# Altium schematic sheet RC_Interface.SchDoc
size A4
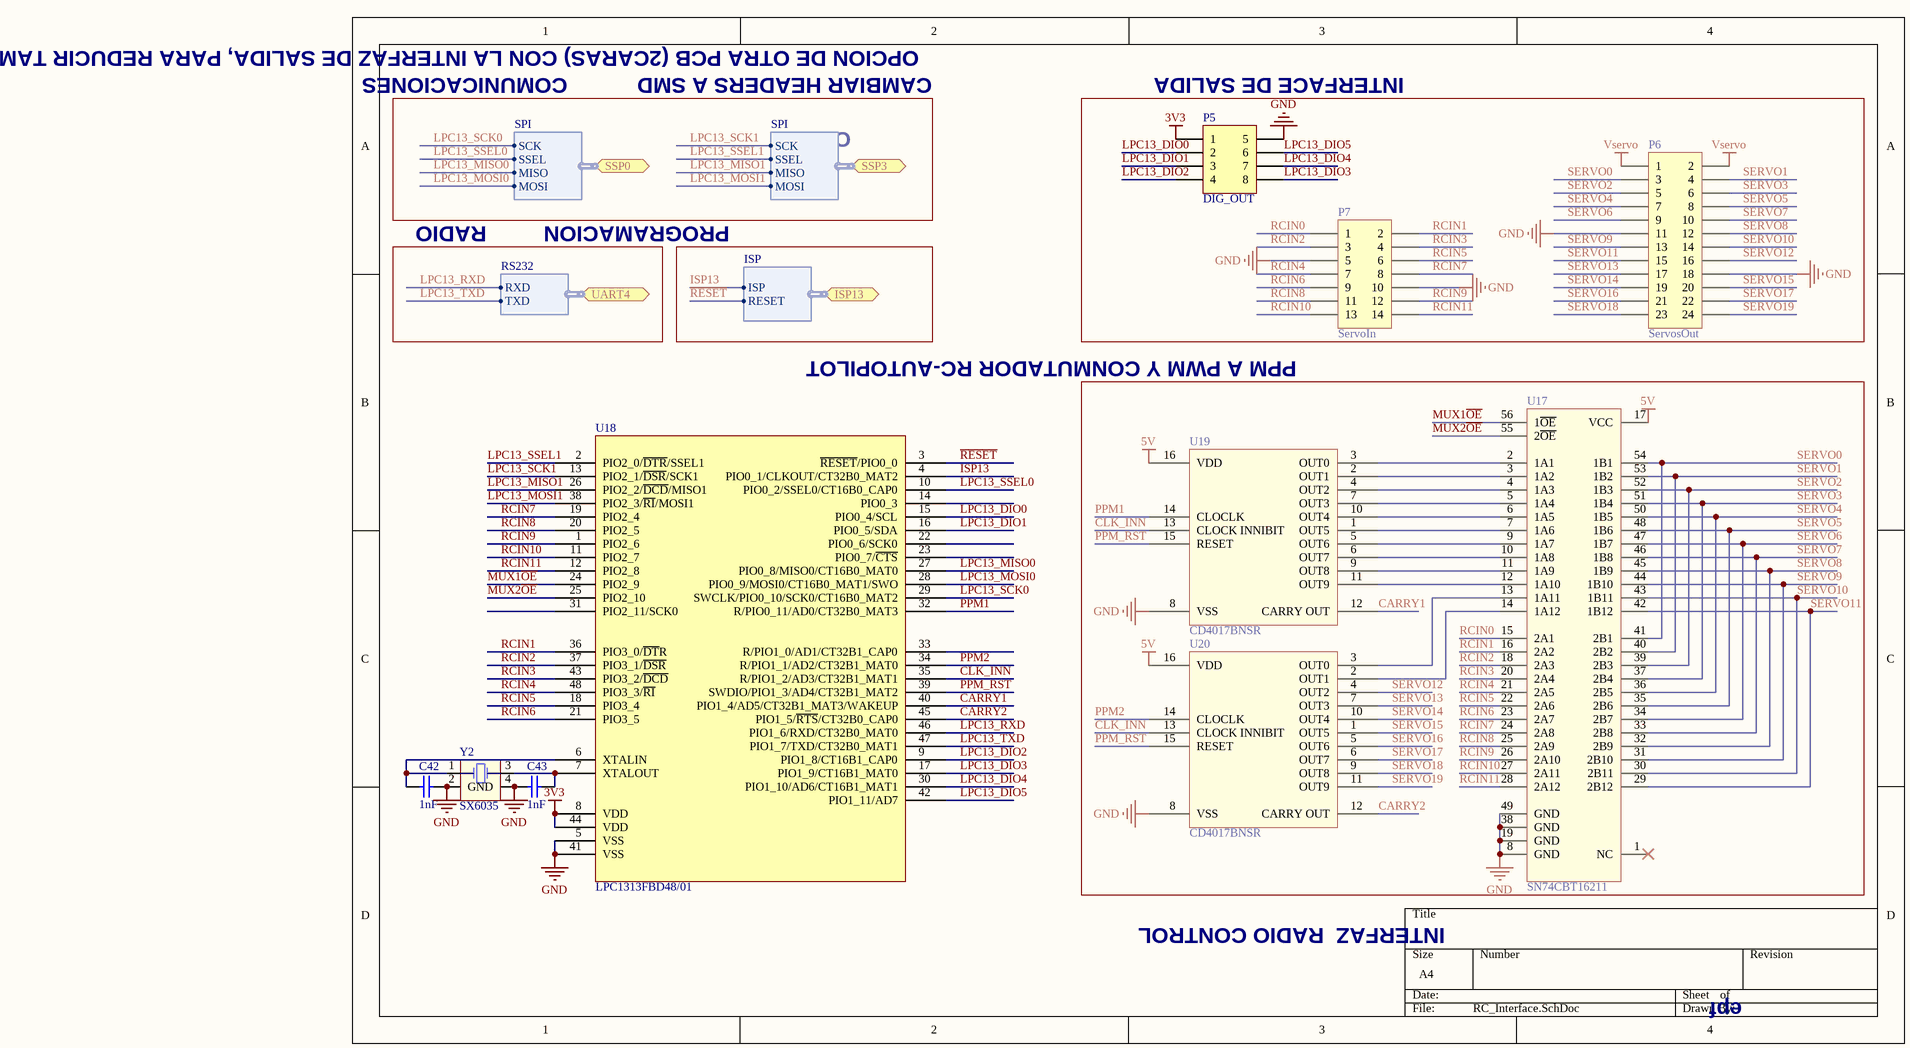
[diagram p0: RC_Interface.SchDoc]

## Parts
C42  value 1nF  [CAP0402]  (hidden comment: Capacitor)
C43  value 1nF  [CAP0402]  (hidden comment: Capacitor)
P5  DIG_OUT  [HDR2X4_CEN]
P6  ServosOut  [HDR 2X12]
P7  ServoIn  [HDR2X7]
U17  SN74CBT16211  [SOP635P1035-56N]
U18  LPC1313FBD48/01  [TQFP48_LPC1343]
U19  CD4017BNSR  [SOIC127P602-16BN]
U20  CD4017BNSR  [SOIC127P602-16BN]
Y2  SX6035  [SX6035]

## Ports
ISP13 (harness ISP), SSP0 (harness SPI), SSP3 (harness SPI), UART4 (harness RS232)

## Harnesses
SPI: SCK, SSEL, MISO, MOSI
RS232: RXD, TXD
ISP: ISP, RESET

## Nets
3V3: P5.1 U18.8(VDD) U18.44(VDD)
5V: U17.17(VCC) U19.16(VDD) U20.16(VDD)
GND: C42.1 C43.2 P5.5 P6.11 P6.18 P7.5 P7.10 U17.8(GND) U17.19(GND) U17.38(GND) U17.49(GND) U18.5(VSS) U18.41(VSS) U19.8(VSS) U20.8(VSS) Y2.2(GND) Y2.4(GND)
Vservo: P6.1 P6.2
~{RESET}: U18.3(~{RESET}/PIO0_0) ; port ISP13.RESET
CARRY1: U18.40(PIO1_4/AD5/CT32B1_MAT3/WAKEUP) U19.12(CARRY_OUT)
CARRY2: U18.45(PIO1_5/~{RTS}/CT32B0_CAP0) U20.12(CARRY_OUT)
CLK_INN: U18.35(R/PIO1_2/AD3/CT32B1_MAT1) U19.13(CLOCK_INNIBIT) U20.13(CLOCK_INNIBIT)
ISP13: U18.4(PIO0_1/CLKOUT/CT32B0_MAT2) ; port ISP13.ISP
LPC13_DIO0: P5.2 U18.15(PIO0_4/SCL)
LPC13_DIO1: P5.3 U18.16(PIO0_5/SDA)
LPC13_DIO2: P5.4 U18.9(PIO1_8/CT16B1_CAP0)
LPC13_DIO3: P5.8 U18.17(PIO1_9/CT16B1_MAT0)
LPC13_DIO4: P5.7 U18.30(PIO1_10/AD6/CT16B1_MAT1)
LPC13_DIO5: P5.6 U18.42(PIO1_11/AD7)
LPC13_MISO0: U18.27(PIO0_8/MISO0/CT16B0_MAT0) ; port SSP0.MISO
LPC13_MISO1: U18.26(PIO2_2/~{DCD}/MISO1) ; port SSP3.MISO
LPC13_MOSI0: U18.28(PIO0_9/MOSI0/CT16B0_MAT1/SWO) ; port SSP0.MOSI
LPC13_MOSI1: U18.38(PIO2_3/~{RI}/MOSI1) ; port SSP3.MOSI
LPC13_RXD: U18.46(PIO1_6/RXD/CT32B0_MAT0) ; port UART4.RXD
LPC13_SCK0: U18.29(SWCLK/PIO0_10/SCK0/CT16B0_MAT2) ; port SSP0.SCK
LPC13_SCK1: U18.13(PIO2_1/~{DSR}/SCK1) ; port SSP3.SCK
LPC13_SSEL0: U18.10(PIO0_2/SSEL0/CT16B0_CAP0) ; port SSP0.SSEL
LPC13_SSEL1: U18.2(PIO2_0/~{DTR}/SSEL1) ; port SSP3.SSEL
LPC13_TXD: U18.47(PIO1_7/TXD/CT32B0_MAT1) ; port UART4.TXD
MUX1~{OE}: U17.56(1~{OE}) U18.24(PIO2_9)
MUX2~{OE}: U17.55(2~{OE}) U18.25(PIO2_10)
PPM1: U18.32(R/PIO0_11/AD0/CT32B0_MAT3) U19.14(CLOCLK)
PPM2: U18.34(R/PIO1_1/AD2/CT32B1_MAT0) U20.14(CLOCLK)
PPM_RST: U18.39(SWDIO/PIO1_3/AD4/CT32B1_MAT2) U19.15(RESET) U20.15(RESET)
RCIN0: P7.1 U17.15(2A1)
RCIN1: P7.2 U17.16(2A2) U18.36(PIO3_0/~{DT}R)
RCIN2: P7.3 U17.18(2A3) U18.37(PIO3_1/~{DSR})
RCIN3: P7.4 U17.20(2A4) U18.43(PIO3_2/~{DCD})
RCIN4: P7.7 U17.21(2A5) U18.48(PIO3_3/~{RI})
RCIN5: P7.6 U17.22(2A6) U18.18(PIO3_4)
RCIN6: P7.9 U17.23(2A7) U18.21(PIO3_5)
RCIN7: P7.8 U17.24(2A8) U18.19(PIO2_4)
RCIN8: P7.11 U17.25(2A9) U18.20(PIO2_5)
RCIN9: P7.12 U17.26(2A10) U18.1(PIO2_6)
RCIN10: P7.13 U17.27(2A11) U18.11(PIO2_7)
RCIN11: P7.14 U17.28(2A12) U18.12(PIO2_8)
SERVO0: P6.3 U17.41(2B1) U17.54(1B1)
SERVO1: P6.4 U17.40(2B2) U17.53(1B2)
SERVO2: P6.5 U17.39(2B3) U17.52(1B3)
SERVO3: P6.6 U17.37(2B4) U17.51(1B4)
SERVO4: P6.7 U17.36(2B5) U17.50(1B5)
SERVO5: P6.8 U17.35(2B6) U17.48(1B6)
SERVO6: P6.9 U17.34(2B7) U17.47(1B7)
SERVO7: P6.10 U17.33(2B8) U17.46(1B8)
SERVO8: P6.12 U17.32(2B9) U17.45(1B9)
SERVO9: P6.13 U17.31(2B10) U17.44(1B10)
SERVO10: P6.14 U17.30(2B11) U17.43(1B11)
SERVO11: P6.15 U17.29(2B12) U17.42(1B12)
SERVO12: P6.16 U20.4(OUT2)
SERVO13: P6.17 U20.7(OUT3)
SERVO14: P6.19 U20.10(OUT4)
SERVO15: P6.20 U20.1(OUT5)
SERVO16: P6.21 U20.5(OUT6)
SERVO17: P6.22 U20.6(OUT7)
SERVO18: P6.23 U20.9(OUT8)
SERVO19: P6.24 U20.11(OUT9)
NetC42_2: C42.2 U18.6(XTALIN) Y2.1(XTAL)
NetC43_1: C43.1 U18.7(XTALOUT) Y2.3(XTAL)
NetU17_2: U17.2(1A1) U19.3(OUT0)
NetU17_3: U17.3(1A2) U19.2(OUT1)
NetU17_4: U17.4(1A3) U19.4(OUT2)
NetU17_5: U17.5(1A4) U19.7(OUT3)
NetU17_6: U17.6(1A5) U19.10(OUT4)
NetU17_7: U17.7(1A6) U19.1(OUT5)
NetU17_9: U17.9(1A7) U19.5(OUT6)
NetU17_10: U17.10(1A8) U19.6(OUT7)
NetU17_11: U17.11(1A9) U19.9(OUT8)
NetU17_12: U17.12(1A10) U19.11(OUT9)
NetU17_13: U17.13(1A11) U20.3(OUT0)
NetU17_14: U17.14(1A12) U20.2(OUT1)

Not connected (* = marked no-connect by the designer): U17 1(NC)*; U18 14(PIO0_3) 22(PIO0_6/SCK0) 23(PIO0_7/~{CTS}) 31(PIO2_11/SCK0) 33(R/PIO1_0/AD1/CT32B1_CAP0)

## Notes on the sheet
- OPCION DE OTRA PCB (2CARAS) CON LA INTERFAZ DE SALIDA, PARA REDUCIR TAMAÑO
- COMUNICACIONES
- OSD
- CAMBIAR HEADERS A SMD
- INTERFACE DE SALIDA
- LPC17
- RADIO
- PROGRAMACION
- PPM A PWM Y CONMUTADOR RC-AUTOPILOT
- INTERFAZ  RADIO CONTROL
- epf

## Library data of the parts
C42 C43 = Cap
P5 = AP_SALIDA_DIGITAL: Header, 4-Pin, Dual row; LatestRevisionDate: 17-Jul-2002; LatestRevisionNote: Re-released for DXP Platform.; Publisher: Altium Limited
P6 = ServosOut: Header, 12-Pin, Dual row; LatestRevisionDate: 17-Jul-2002; LatestRevisionNote: Re-released for DXP Platform.; Publisher: Altium Limited
P7 = ServoIn: Header, 7-Pin, Dual row; LatestRevisionDate: 17-Jul-2002; LatestRevisionNote: Re-released for DXP Platform.; Publisher: Altium Limited
U17 = SN74CBT16211: MUX
U18 = LPC1313FBD48/01: ARM CortexM3 32K Flash, 8k RAM
U19 U20 = CD4017BNSR: COUNTER/DIVIDERS
Y2 = XTAL_SX6035